# EAGLE schematic jopcore (EAGLE 4.08)
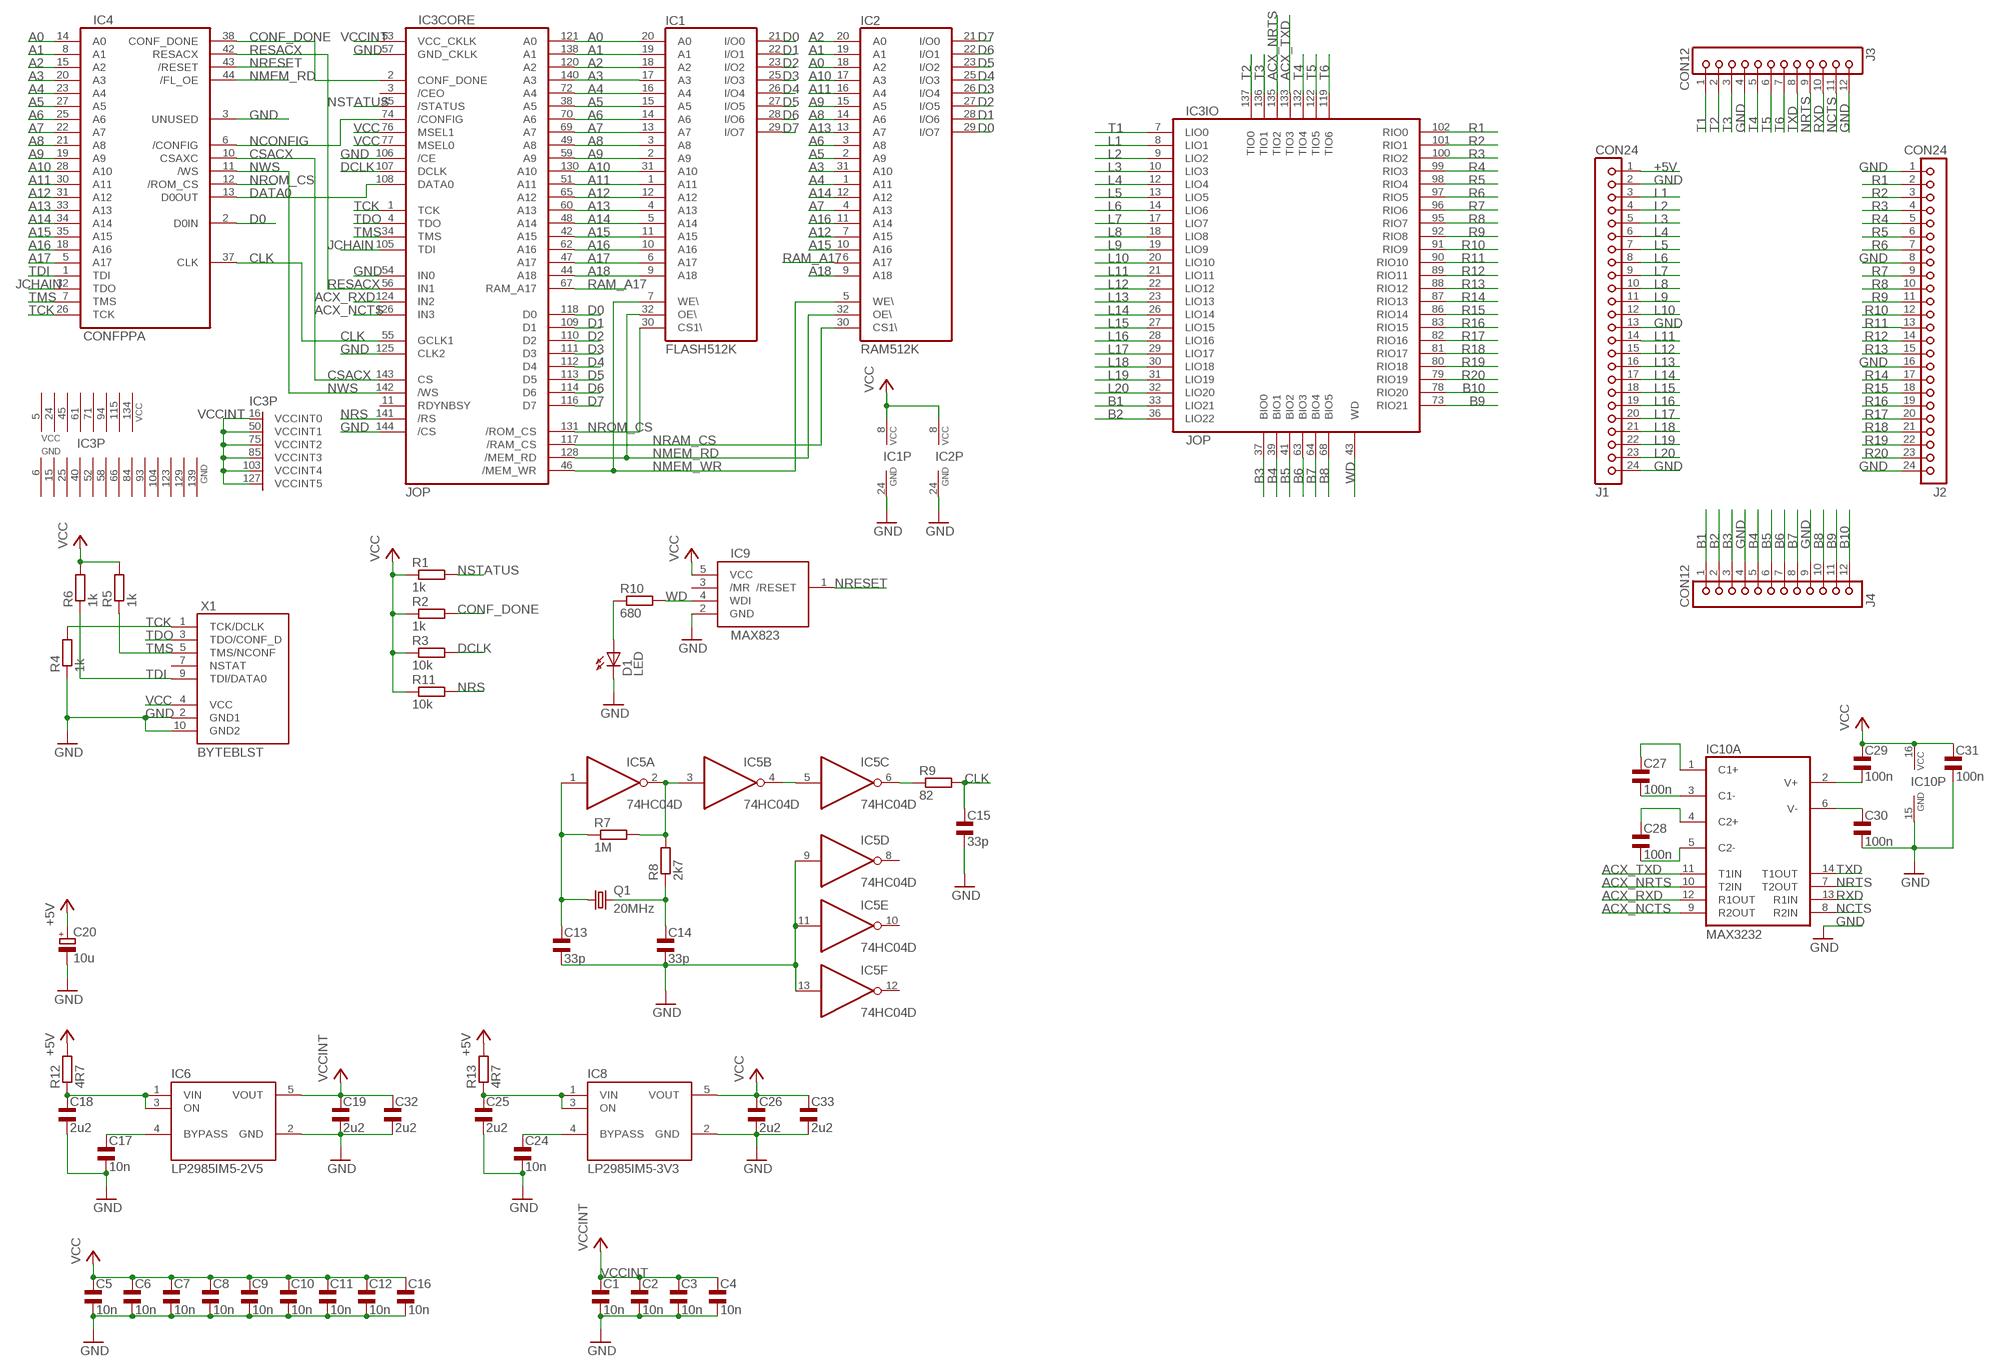
[diagram p0: schematic, sheet 1]

## Parts
C1  10n  C0805  [0805]
C2  10n  C0805  [0805]
C3  10n  C0805  [0805]
C4  10n  C0805  [0805]
C5  10n  C0805  [0805]
C6  10n  C0805  [0805]
C7  10n  C0805  [0805]
C8  10n  C0805  [0805]
C9  10n  C0805  [0805]
C10  10n  C0805  [0805]
C11  10n  C0805  [0805]
C12  10n  C0805  [0805]
C13  33p  C0805  [0805]
C14  33p  C0805  [0805]
C15  33p  C0805  [0805]
C16  10n  C0805  [0805]
C17  10n  C0805  [0805]
C18  2u2  C1206  [1206]
C19  2u2  C1206  [1206]
C20  10u  CE-C  [CE-C]
C24  10n  C0805  [0805]
C25  2u2  C1206  [1206]
C26  2u2  C1206  [1206]
C27  100n  C0805  [0805]
C28  100n  C0805  [0805]
C29  100n  C0805  [0805]
C30  100n  C0805  [0805]
C31  100n  C0805  [0805]
C32  2u2  C1206  [1206]
C33  2u2  C1206  [1206]
D1  LED  [LED]
IC1  FLASH512K  [TSOP32]
IC2  RAM512K  [TSOP32]
IC3  JOP  [TQFP144]
IC4  CONFPPA  [TQFP44]
IC5  74HC04D  [SO14]
IC6  LP2985IM5-2V5  LP2985IM5  [SOT23-5]
IC8  LP2985IM5-3V3  LP2985IM5  [SOT23-5]
IC9  MAX823  [SOT23-5]
IC10  MAX3232  MAX232A  [SO16]
J1  CON24  [CON24]
J2  CON24  [CON24]
J3  CON12  [CON12]
J4  CON12  [CON12]
Q1  20MHz  HC49U-V  [HC49U-V]
R1  1k  R0805  [0805]
R2  1k  R0805  [0805]
R3  10k  R0805  [0805]
R4  1k  R0805  [0805]
R5  1k  R0805  [0805]
R6  1k  R0805  [0805]
R7  1M  R0805  [0805]
R8  2k7  R0805  [0805]
R9  82  R0805  [0805]
R10  680  R0805  [0805]
R11  10k  R0805  [0805]
R12  4R7  R0805  [0805]
R13  4R7  R0805  [0805]
X1  BYTEBLST  [BYTEBLST]

## Nets
20MHZ: C14.2 Q1.2 R8.1
+5V: C20.+ J1.1 R12.2 R13.2
A0: IC1.20(A0) IC2.18(A2) IC3.121(CORE:A0) IC4.14(A0)
A1: IC1.19(A1) IC2.19(A1) IC3.138(CORE:A1) IC4.8(A1)
A2: IC1.18(A2) IC2.20(A0) IC3.120(CORE:A2) IC4.15(A2)
A3: IC1.17(A3) IC2.31(A10) IC3.140(CORE:A3) IC4.20(A3)
A4: IC1.16(A4) IC2.1(A11) IC3.72(CORE:A4) IC4.23(A4)
A5: IC1.15(A5) IC2.2(A9) IC3.38(CORE:A5) IC4.27(A5)
A6: IC1.14(A6) IC2.3(A8) IC3.70(CORE:A6) IC4.25(A6)
A7: IC1.13(A7) IC2.4(A13) IC3.69(CORE:A7) IC4.22(A7)
A8: IC1.3(A8) IC2.14(A6) IC3.49(CORE:A8) IC4.21(A8)
A9: IC1.2(A9) IC2.15(A5) IC3.59(CORE:A9) IC4.19(A9)
A10: IC1.31(A10) IC2.17(A3) IC3.130(CORE:A10) IC4.28(A10)
A11: IC1.1(A11) IC2.16(A4) IC3.51(CORE:A11) IC4.30(A11)
A12: IC1.12(A12) IC2.7(A15) IC3.65(CORE:A12) IC4.31(A12)
A13: IC1.4(A13) IC2.13(A7) IC3.60(CORE:A13) IC4.33(A13)
A14: IC1.5(A14) IC2.12(A12) IC3.48(CORE:A14) IC4.34(A14)
A15: IC1.11(A15) IC2.10(A16) IC3.42(CORE:A15) IC4.35(A15)
A16: IC1.10(A16) IC2.11(A14) IC3.62(CORE:A16) IC4.18(A16)
A17: IC1.6(A17) IC3.47(CORE:A17) IC4.5(A17)
A18: IC1.9(A18) IC2.9(A18) IC3.44(CORE:A18)
ACX_NCTS: IC3.126(CORE:IN3) IC10.9(A:R2OUT)
ACX_NRTS: IC3.135(IO:TIO2) IC10.10(A:T2IN)
ACX_RXD: IC3.124(CORE:IN2) IC10.12(A:R1OUT)
ACX_TXD: IC3.133(IO:TIO3) IC10.11(A:T1IN)
B1: IC3.33(IO:LIO21) J4.1
B2: IC3.36(IO:LIO22) J4.2
B3: IC3.37(IO:BIO0) J4.3
B4: IC3.39(IO:BIO1) J4.5
B5: IC3.41(IO:BIO2) J4.6
B6: IC3.63(IO:BIO3) J4.7
B7: IC3.64(IO:BIO4) J4.8
B8: IC3.68(IO:BIO5) J4.10
B9: IC3.73(IO:RIO21) J4.11
B10: IC3.78(IO:RIO20) J4.12
CLK: C15.2 IC3.55(CORE:GCLK1) IC4.37(CLK) R9.2
CONF_DONE: IC3.2(CORE:CONF_DONE) IC4.38(CONF_DONE) R2.2
CSACX: IC3.143(CORE:CS) IC4.10(CSAXC)
D0: IC1.21(I/O0) IC2.29(I/O7) IC3.118(CORE:D0) IC4.2(D0IN)
D1: IC1.22(I/O1) IC2.28(I/O6) IC3.109(CORE:D1)
D2: IC1.23(I/O2) IC2.27(I/O5) IC3.110(CORE:D2)
D3: IC1.25(I/O3) IC2.26(I/O4) IC3.111(CORE:D3)
D4: IC1.26(I/O4) IC2.25(I/O3) IC3.112(CORE:D4)
D5: IC1.27(I/O5) IC2.23(I/O2) IC3.113(CORE:D5)
D6: IC1.28(I/O6) IC2.22(I/O1) IC3.114(CORE:D6)
D7: IC1.29(I/O7) IC2.21(I/O0) IC3.116(CORE:D7)
DATA0: IC3.108(CORE:DATA0) IC4.13(D0OUT)
DCLK: IC3.107(CORE:DCLK) R3.2
GND: C1.1 C2.1 C3.1 C4.1 C5.1 C6.1 C7.1 C8.1 C9.1 C10.1 C11.1 C12.1 C13.1 C14.1 C15.1 C16.1 C17.1 C18.1 C19.1 C20.- C24.1 C25.1 C26.1 C30.1 C31.1 C32.1 C33.1 D1.2(C) IC1.24(GND) IC2.24(GND) IC3.54(CORE:IN0) IC3.57(CORE:GND_CKLK) IC3.106(CORE:/CE) IC3.125(CORE:CLK2) IC3.144(CORE:/CS) IC4.3(UNUSED) IC5.9(D:I) IC5.11(E:I) IC5.13(F:I) IC6.2(GND) IC8.2(GND) IC9.2(GND) IC10.15(P:GND) J1.2 J1.13 J1.24 J2.1 J2.8 J2.16 J2.24 J3.4 J3.12 J4.4 J4.9 R4.1 X1.2(GND1) X1.10(GND2)
JCHAIN: IC3.105(CORE:TDI) IC4.32(TDO)
L1: IC3.8(IO:LIO1) J1.3
L2: IC3.9(IO:LIO2) J1.4
L3: IC3.10(IO:LIO3) J1.5
L4: IC3.12(IO:LIO4) J1.6
L5: IC3.13(IO:LIO5) J1.7
L6: IC3.14(IO:LIO6) J1.8
L7: IC3.17(IO:LIO7) J1.9
L8: IC3.18(IO:LIO8) J1.10
L9: IC3.19(IO:LIO9) J1.11
L10: IC3.20(IO:LIO10) J1.12
L11: IC3.21(IO:LIO11) J1.14
L12: IC3.22(IO:LIO12) J1.15
L13: IC3.23(IO:LIO13) J1.16
L14: IC3.26(IO:LIO14) J1.17
L15: IC3.27(IO:LIO15) J1.18
L16: IC3.28(IO:LIO16) J1.19
L17: IC3.29(IO:LIO17) J1.20
L18: IC3.30(IO:LIO18) J1.21
L19: IC3.31(IO:LIO19) J1.22
L20: IC3.32(IO:LIO20) J1.23
N$1: IC5.4(B:O) IC5.5(C:I)
N$2: IC5.6(C:O) R9.1
N$3: IC5.2(A:O) IC5.3(B:I) R7.2 R8.2
N$5: C13.2 IC5.1(A:I) Q1.1 R7.1
N$6: C17.2 IC6.4(BYPASS)
N$7: D1.1(A) R10.1
N$11: C27.1 IC10.3(A:C1-)
N$12: C28.1 IC10.5(A:C2-)
N$13: C24.2 IC8.4(BYPASS)
N$14: C29.1 IC10.2(A:V+)
N$15: C30.2 IC10.6(A:V-)
N$21: C27.2 IC10.1(A:C1+)
N$22: C28.2 IC10.4(A:C2+)
NCONFIG: IC3.74(CORE:/CONFIG) IC4.6(/CONFIG)
NCTS: IC10.8(A:R2IN) J3.11
NMEM_RD: IC1.32(OE\) IC2.32(OE\) IC3.128(CORE:/MEM_RD) IC4.44(/FL_OE)
NMEM_WR: IC1.7(WE\) IC2.5(WE\) IC3.46(CORE:/MEM_WR)
NRAM_CS: IC2.30(CS1\) IC3.117(CORE:/RAM_CS)
NRESET: IC4.43(/RESET) IC9.1(/RESET)
NROM_CS: IC1.30(CS1\) IC3.131(CORE:/ROM_CS) IC4.12(/ROM_CS)
NRS: IC3.141(CORE:/RS) R11.2
NRTS: IC10.7(A:T2OUT) J3.9
NSTATUS: IC3.35(CORE:/STATUS) R1.2
NWS: IC3.142(CORE:/WS) IC4.11(/WS)
R1: IC3.102(IO:RIO0) J2.2
R2: IC3.101(IO:RIO1) J2.3
R3: IC3.100(IO:RIO2) J2.4
R4: IC3.99(IO:RIO3) J2.5
R5: IC3.98(IO:RIO4) J2.6
R6: IC3.97(IO:RIO5) J2.7
R7: IC3.96(IO:RIO6) J2.9
R8: IC3.95(IO:RIO7) J2.10
R9: IC3.92(IO:RIO8) J2.11
R10: IC3.91(IO:RIO9) J2.12
R11: IC3.90(IO:RIO10) J2.13
R12: IC3.89(IO:RIO11) J2.14
R13: IC3.88(IO:RIO12) J2.15
R14: IC3.87(IO:RIO13) J2.17
R15: IC3.86(IO:RIO14) J2.18
R16: IC3.83(IO:RIO15) J2.19
R17: IC3.82(IO:RIO16) J2.20
R18: IC3.81(IO:RIO17) J2.21
R19: IC3.80(IO:RIO18) J2.22
R20: IC3.79(IO:RIO19) J2.23
RAM_A17: IC2.6(A17) IC3.67(CORE:RAM_A17)
RESACX: IC3.56(CORE:IN1) IC4.42(RESACX)
RXD: IC10.13(A:R1IN) J3.10
T1: IC3.7(IO:LIO0) J3.1
T2: IC3.137(IO:TIO0) J3.2
T3: IC3.136(IO:TIO1) J3.3
T4: IC3.132(IO:TIO4) J3.5
T5: IC3.122(IO:TIO5) J3.6
T6: IC3.119(IO:TIO6) J3.7
TCK: IC3.1(CORE:TCK) IC4.26(TCK) R4.2 X1.1(TCK/DCLK)
TDI: IC4.1(TDI) R6.1 X1.9(TDI/DATA0)
TDO: IC3.4(CORE:TDO) X1.3(TDO/CONF_D)
TMS: IC3.34(CORE:TMS) IC4.7(TMS) R5.1 X1.5(TMS/NCONF)
TXD: IC10.14(A:T1OUT) J3.8
VCC: C5.2 C6.2 C7.2 C8.2 C9.2 C10.2 C11.2 C12.2 C16.2 C26.2 C29.2 C31.2 C33.2 IC1.8(VCC) IC2.8(VCC) IC3.76(CORE:MSEL1) IC3.77(CORE:MSEL0) IC8.5(VOUT) IC9.5(VCC) IC10.16(P:VCC) R1.1 R2.1 R3.1 R5.2 R6.2 R11.1 X1.4(VCC)
VCCINT: C1.2 C2.2 C3.2 C4.2 C19.2 C32.2 IC3.16(P:VCCINT0) IC3.50(P:VCCINT1) IC3.53(CORE:VCC_CKLK) IC3.75(P:VCCINT2) IC3.85(P:VCCINT3) IC3.103(P:VCCINT4) IC3.127(P:VCCINT5) IC6.5(VOUT)
VIN2V5: C25.2 IC8.1(VIN) IC8.3(ON) R13.1
VIN3V3: C18.2 IC6.1(VIN) IC6.3(ON) R12.1
WD: IC3.43(IO:WD) IC9.4(WDI) R10.2
Unconnected: IC3.3(CORE:/CEO) IC3.11(CORE:RDYNBSY) IC5.8(D:O) IC5.10(E:O) IC5.12(F:O) IC9.3(/MR) X1.7(NSTAT)

## Power pins joined to a net without a drawn wire
GND: IC3.6(P:GND) IC3.15(P:GND) IC3.25(P:GND) IC3.40(P:GND) IC3.52(P:GND) IC3.58(P:GND) IC3.66(P:GND) IC3.84(P:GND) IC3.93(P:GND) IC3.104(P:GND) IC3.123(P:GND) IC3.129(P:GND) IC3.139(P:GND) IC4.4(GND) IC4.16(GND) IC4.24(GND) IC4.36(GND) IC4.39(GND) IC4.40(GND) IC5.7(P:GND)
VCC: IC3.5(P:VCC) IC3.24(P:VCC) IC3.45(P:VCC) IC3.61(P:VCC) IC3.71(P:VCC) IC3.94(P:VCC) IC3.115(P:VCC) IC3.134(P:VCC) IC4.9(VCC) IC4.17(VCC) IC4.29(VCC) IC4.41(VCC) IC5.14(P:VCC)

## Library data of the parts
C1-C17 C24 C27-C31 = MY_EAGLE:C0805
C18 C19 C25 C26 C32 C33 = MY_EAGLE:C1206
C20 = MY_EAGLE:CE-C
D1 = MY_EAGLE:LED
IC1 = MY_EAGLE:FLASH512K
IC2 = MY_EAGLE:RAM512K
IC3 = MY_EAGLE:JOP
IC4 = MY_EAGLE:CONFPPA
IC5 = 74xx-eu:74*04: Hex INVERTER
IC6 IC8 = MY_EAGLE:LP2985IM5
IC9 = MY_EAGLE:MAX823
IC10 = MY_EAGLE:MAX232A
J1 J2 = MY_EAGLE:CON24
J3 J4 = MY_EAGLE:CON12
Q1 = crystal:HC49U-V: CRYSTAL
R1-R13 = MY_EAGLE:R0805
X1 = MY_EAGLE:BYTEBLST